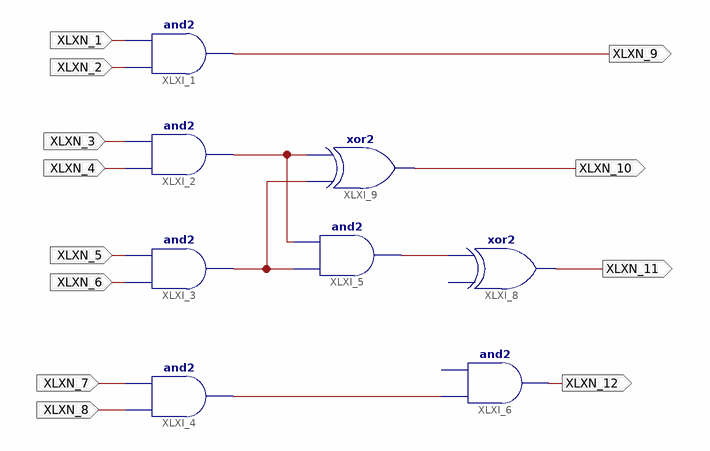
[diagram p0: schematic sheet 1]
// Xilinx ISE schematic Arithmetic2BitsMUL_sch.sch (spartan3a) as structural Verilog: 8 symbols, 12 ports
module Arithmetic2BitsMUL_sch (
  input  XLXN_5,
  input  XLXN_6,
  input  XLXN_7,
  input  XLXN_8,
  input  XLXN_2,
  input  XLXN_1,
  input  XLXN_3,
  input  XLXN_4,
  output XLXN_11,
  output XLXN_9,
  output XLXN_10,
  output XLXN_12
);

  wire XLXN_26, XLXN_27, XLXN_28, XLXN_34;

  and XLXI_3 (XLXN_27, XLXN_6, XLXN_5);
  and XLXI_4 (XLXN_34, XLXN_8, XLXN_7);
  and XLXI_5 (XLXN_28, XLXN_27, XLXN_26);
  buf XLXI_8 (XLXN_11, XLXN_28);  // xor2 open: I0
  and XLXI_1 (XLXN_9, XLXN_2, XLXN_1);
  and XLXI_2 (XLXN_26, XLXN_4, XLXN_3);
  xor XLXI_9 (XLXN_10, XLXN_27, XLXN_26);
  buf XLXI_6 (XLXN_12, XLXN_34);  // and2 open: I1
endmodule
